# Altium schematic sheet Main.SchDoc
size A4; SheetNumber: 1; SheetTotal: 4
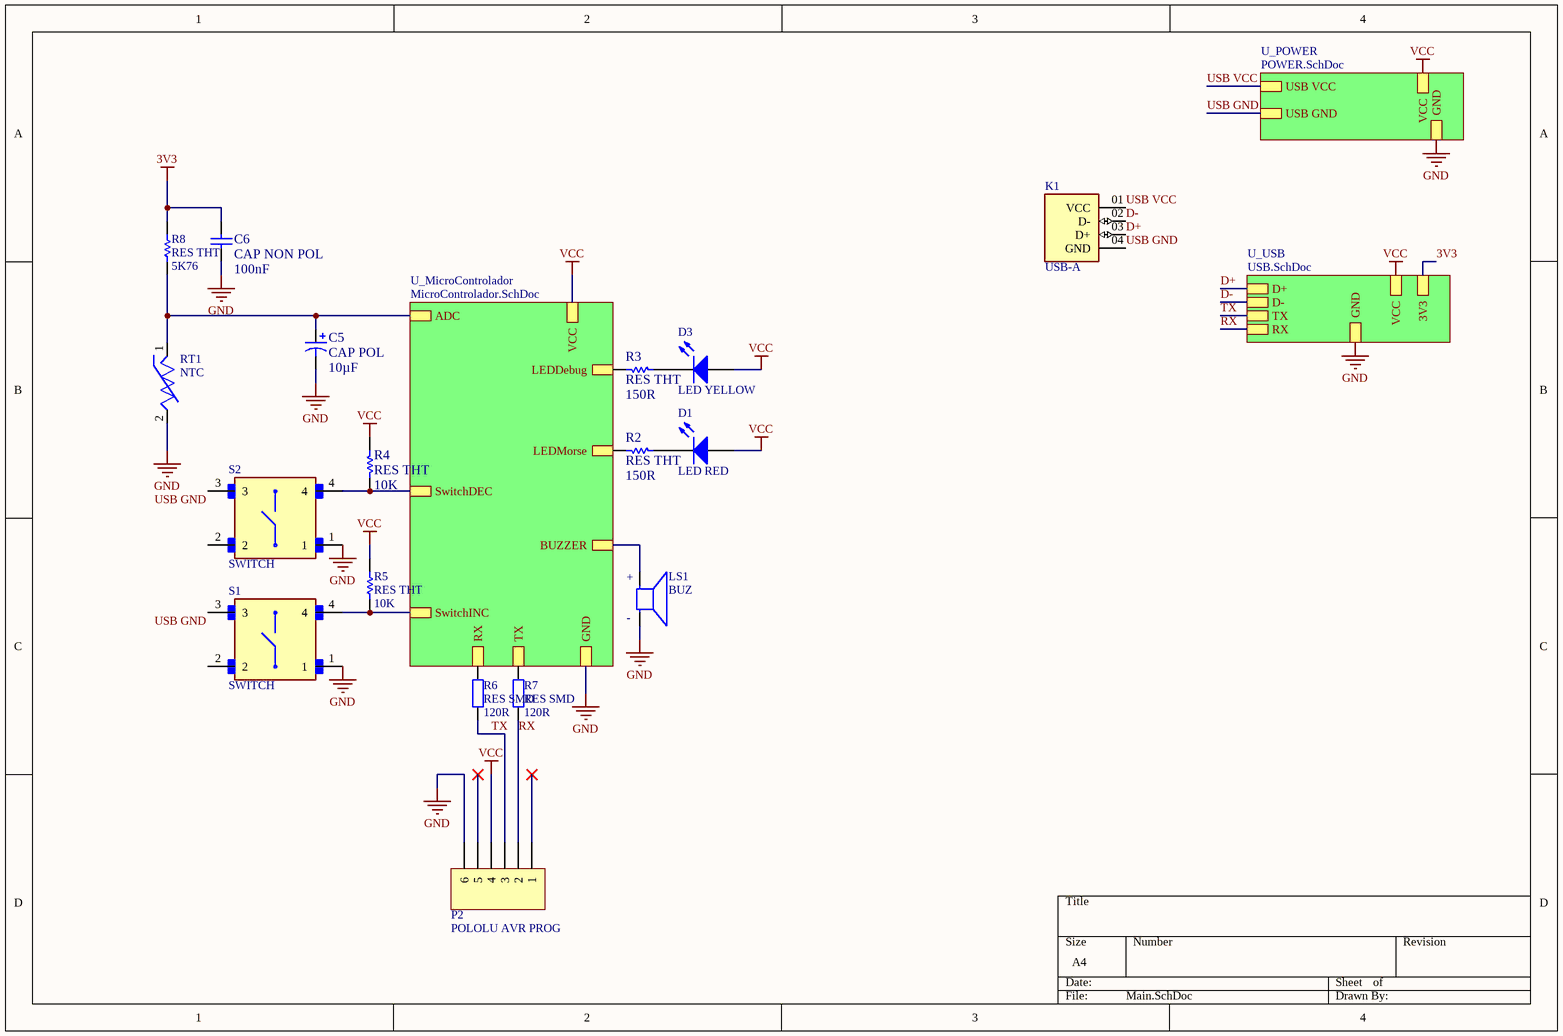
[diagram p0: Main.SchDoc]

## Parts
C5  CAP POL  value 10µF  [CONDENS 10uF]
C6  CAP NON POL  value 100nF  [Capacitor 100nF]
D1  LED RED  [LED 5mm]
D3  LED YELLOW  [LED 5mm]
K1  USB-A  [USB]
LS1  BUZ  [BUZZ]
P2  POLOLU AVR PROG  [Connector Header 1x6]
R2  RES THT  value 150R  [RESISTENCIA]
R3  RES THT  value 150R  [RESISTENCIA]
R4  RES THT  value 10K  [RESISTENCIA]
R5  RES THT  value 10K  [RESISTENCIA]
R6  RES SMD  value 120R  [RES SMDD]
R7  RES SMD  value 120R  [RES SMDD]
R8  RES THT  value 5K76  [RESISTENCIA]
RT1  NTC  [NTC]
S1  SWITCH  [Switch Tactile]
S2  SWITCH  [Switch Tactile]

## Sub-sheets
U_MicroControlador = MicroControlador.SchDoc: VCC, GND, LEDDebug, LEDMorse, SwitchINC, SwitchDEC, RX, TX, BUZZER, ADC
U_POWER = POWER.SchDoc: VCC, GND, USB VCC, USB GND
U_USB = USB.SchDoc: D+, D-, TX, RX, VCC, GND, 3V3

## Nets
3V3: C6.2 R8.2 ; sheet U_USB/3V3
GND: C5.2 C6.1 LS1.N P2.6 RT1.2 S1.1 S2.1 ; sheet U_MicroControlador/GND, sheet U_POWER/GND, sheet U_USB/GND
VCC: D1.1(A) D3.1(A) P2.4 R4.1 R5.1 ; sheet U_MicroControlador/VCC, sheet U_POWER/VCC, sheet U_USB/VCC
D+: K1.03(D+) ; sheet U_USB/D+
D-: K1.02(D-) ; sheet U_USB/D-
RX: P2.2 R7.1 ; sheet U_USB/RX
TX: P2.3 R6.1 ; sheet U_USB/TX
USB GND: K1.04(GND) S1.3 S2.3 ; sheet U_POWER/USB GND
USB VCC: K1.01(VCC) ; sheet U_POWER/USB VCC
NetC5_1: C5.1 R8.1 RT1.1 ; sheet U_MicroControlador/ADC
NetD1_2: D1.2(K) R2.2
NetD3_2: D3.2(K) R3.2
NetLS1_P: LS1.P ; sheet U_MicroControlador/BUZZER
NetR2_1: R2.1 ; sheet U_MicroControlador/LEDMorse
NetR3_1: R3.1 ; sheet U_MicroControlador/LEDDebug
NetR4_2: R4.2 S2.4 ; sheet U_MicroControlador/SwitchDEC
NetR5_2: R5.2 S1.4 ; sheet U_MicroControlador/SwitchINC
NetR6_2: R6.2 ; sheet U_MicroControlador/RX
NetR7_2: R7.2 ; sheet U_MicroControlador/TX

Not connected (* = marked no-connect by the designer): P2 1* 5*; S1 2; S2 2

## Notes on the sheet
- (in symbol BUZ) +; -

## Library data of the parts
C5 = Cap Pol2: Polarized Capacitor (Axial); Published: 8-Jun-2000; LatestRevisionDate: 17-Jul-2002; LatestRevisionNote: Re-released for DXP Platform.; PackageReference: POLAR0.8; Publisher: Altium Limited; PackageDescription: Polarized Capacitor; 2 Leads
C6 = Cap: Capacitor; Published: 8-Jun-2000; LatestRevisionDate: 17-Jul-2002; LatestRevisionNote: Re-released for DXP Platform.; PackageReference: RAD-0.3; Publisher: Altium Limited; PackageDescription: Radial Cap, Thru-Hole; 2 Leads; 0.3 in Pin Spacing
D1 D3 = LED1: Typical RED GaAs LED; Published: 8-Jun-2000; LatestRevisionDate: 08-Jul-2005; LatestRevisionNote: Mech Layer 1 removed.; PackageReference: LED-1; Publisher: Altium Limited; PackageDescription: LED; 2 Leads
LS1 = BUZ: Magnetic Transducer Buzzer; Published: 24-Mar-1999; LatestRevisionDate: 17-Dec-2003; LatestRevisionNote: Schematic revised, PCB Footprint replaced.; DatasheetVersion: 17-Dec-2003; PackageReference: ABSM-1574; Publisher: Altium Limited; PackageDescription: Magnetic Transducer Buzzer; ComponentLink1Description: Manufacturer Link; ComponentLink1URL: http://www.megastar.com/linecard/buzzmode/index.php
P2 = Header 6: Header, 6-Pin; LatestRevisionDate: 17-Jul-2002; LatestRevisionNote: Re-released for DXP Platform.; Publisher: Altium Limited
R2-R5 R8 = Res1: Resistor; Published: 8-Jun-2000; LatestRevisionDate: 17-Jul-2002; LatestRevisionNote: Re-released for DXP Platform.; PackageReference: AXIAL-0.3; Publisher: Altium Limited; PackageDescription: Axial Device, Thru-Hole; 2 Leads; 0.3 in Pin Spacing
R6 R7 = RES SMD: Resistor; Published: 8-Jun-2000; LatestRevisionDate: 17-Jul-2002; LatestRevisionNote: Re-released for DXP Platform.; PackageReference: AXIAL-0.4; Publisher: Altium Limited; PackageDescription: Axial Device, Thru-Hole; 2 Leads; 0.4 in Pin Spacing
RT1 = NTC: Thermistor; Published: 24-Mar-1999; LatestRevisionDate: 29-May-2009; LatestRevisionNote: IPC-7351 Footprint Added.; PackageVersion: Mar-2003; PackageReference: 6-0805; Publisher: Altium Limited; PackageDescription: Chip Resistor 0805 Case Size; Code_IPC: RESC2012
S1 S2 = SW-DPST: Double-Pole, Single-Throw Switch; Published: 24-Mar-1999; LatestRevisionDate: 17-Jul-2002; LatestRevisionNote: Re-released for DXP Platform.; PackageReference: DPST-4; Publisher: Altium Limited; PackageDescription: Switch; 4 Leads